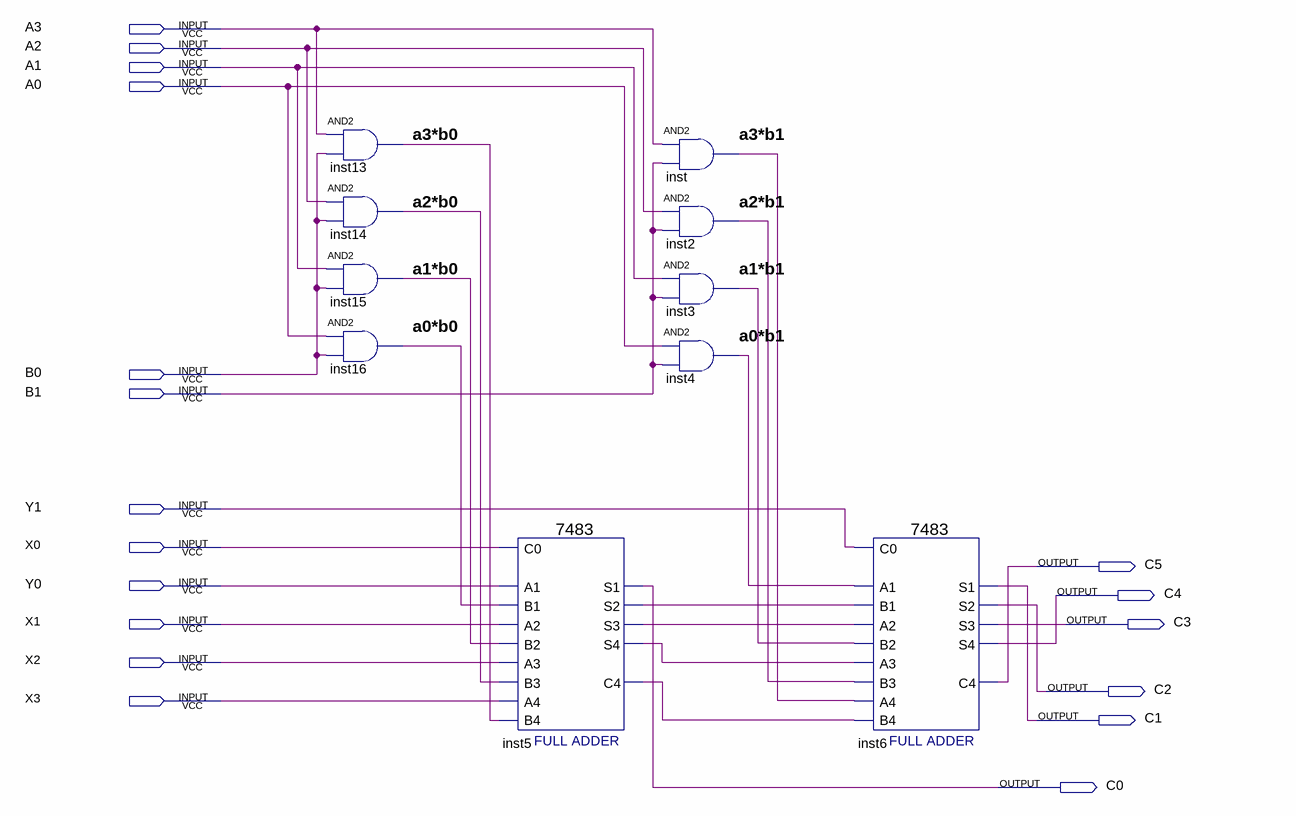
[diagram p0: schematic sheet]
// Quartus schematic MSB4_2.bdf as structural Verilog: 10 symbols, 18 pins
module MSB4_2 (
  input  A3,
  input  A2,
  input  A1,
  input  A0,
  input  B0,
  input  B1,
  input  Y1,
  input  X0,
  input  Y0,
  input  X1,
  input  X2,
  input  X3,
  output C5,
  output C4,
  output C3,
  output C2,
  output C1,
  output C0
);

  wire inst2_out, inst3_out, inst4_out, inst5_c4, inst5_s2, inst5_s3, inst5_s4, inst13_out, inst14_out,
       inst15_out, inst16_out, inst_out;

  and inst13 (inst13_out, A3, B0);
  and inst14 (inst14_out, A2, B0);
  and inst15 (inst15_out, A1, B0);
  and inst16 (inst16_out, A0, B0);
  \7483  inst5 (
    .B4(inst13_out), .C0(X0), .A1(Y0), .A2(X1), .B1(inst16_out), .B2(inst15_out), .A3(X2), .B3(inst14_out),
    .A4(X3), .S3(inst5_s3), .S4(inst5_s4), .S2(inst5_s2), .C4(inst5_c4), .S1(C0));
  and inst (inst_out, A3, B1);
  and inst2 (inst2_out, A2, B1);
  and inst3 (inst3_out, A1, B1);
  and inst4 (inst4_out, A0, B1);
  \7483  inst6 (
    .B4(inst5_c4), .C0(Y1), .A1(inst4_out), .A2(inst5_s3), .B1(inst5_s2), .B2(inst3_out), .A3(inst5_s4),
    .B3(inst2_out), .A4(inst_out), .S3(C3), .S4(C4), .S2(C2), .C4(C5), .S1(C1));

  // Notes on the sheet:
  //   a3*b0
  //   a3*b1
  //   a2*b0
  //   a2*b1
  //   a1*b0
  //   a1*b1
  //   a0*b0
  //   a0*b1
endmodule
